# Altium project relay_sheild.PrjPcb
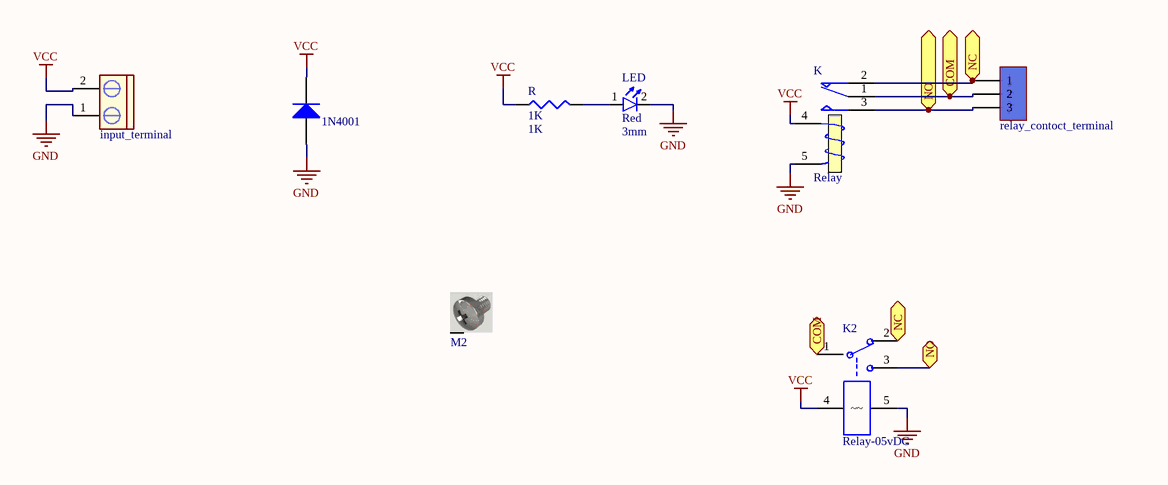
[diagram p0: Sheet1.SchDoc]
2 sheets, 17 parts. Net scope: flat (ports and power ports of the same name join across sheets).
Board files: PCB1.PcbDoc, PCB2.PcbDoc, Dual_Channel_Common_VCC_PCB.PcbDoc, Dual_Channel_Common_VCC_PCB_X2.PcbDoc, Dual_Channel_Common_VCC_PCB_X4.PcbDoc, PCB2_X4.PcbDoc, PCB2_X10.PcbDoc
Sheets:
  Sheet1.SchDoc
  Dual_Channel_Common_VCC.SchDoc

## Sheet Sheet1.SchDoc
size A

### Parts
(Parts that share a designator on the sheet are numbered #1, #2 ... from top to bottom, then left to right.)
1N4001  Diode 1N4007 vertical  [D 50mm]  (value not drawn)
input_terminal#1  CON2 pin blue  [My_CN2]  (value not drawn)
K  Relay  [Relay 15.40x12.10x13.10]
K2  Relay-05vDC  [Relays]
LED  Size: 3mm  [LED-3mm]  (hidden comment: Red)
M2  Screw  [Board Screw_No Silk]  (value not drawn)
R  1K  [AXIAL0.4]
relay_contoct_terminal  Terminal  [Terminal 1*3]  (value not drawn)

### Ports
COM, NC, NO

### Nets
GND: 1N4001.1(A) input_terminal#1.1 K.5(T2) K2.5 LED.2(K)
VCC: 1N4001.2(K) input_terminal#1.2 K.4(T1) K2.4 R.1
NetK_1: K.1(COM) K2.1(COM) relay_contoct_terminal.2 ; port COM
NetK_2: K.2(NC) K2.2(NC) relay_contoct_terminal.1 ; port NC
NetK_3: K.3(NO) K2.3(NO) relay_contoct_terminal.3 ; port NO
NetLED_1: LED.1(A) R.2

Not connected (* = marked no-connect by the designer): M2 S

### Library data of the parts
1N4001 = Diode 1N4007 vertical: 1 Amp General Purpose Rectifier; Publisher: seyed mohsen ghasemian
input_terminal#1 = CON2 pin blue: Connector blue screw
K = Relay: SPDT Relay; Designer: Eng. Saeid Jorablo; Company: E.P.I.L; Design_Date: 2011/10/31
K2 = Relay-05vDC: Relay-05vDC-240AC 5A; Designer: Seyed Mohsen Ghasemain; ComponentLinkURL: www.picpars.com
LED = LED: Designer: Saeid Jorablo; Organazation: ControTec; Adding Date: 1387/12/22; Color: Red
M2 = Board Screw: Board Screw With Spacer
R = Res3: Resistor; Published: 8-Jun-2000; LatestRevisionDate: 29-May-2009; LatestRevisionNote: IPC-7351 Footprint Added.; PackageReference: J1-0603; Publisher: Altium Limited; PackageDescription: Chip Resistor; Value: 1K
relay_contoct_terminal = Terminal 1*3: Terminal 3 Pin 250VAC 16A; Designer: Seyed Mohsen Ghasemain; E-mail: picpars@gmail.com; ComponentLinkURL: www.picpars.com

## Sheet Dual_Channel_Common_VCC.SchDoc
size A
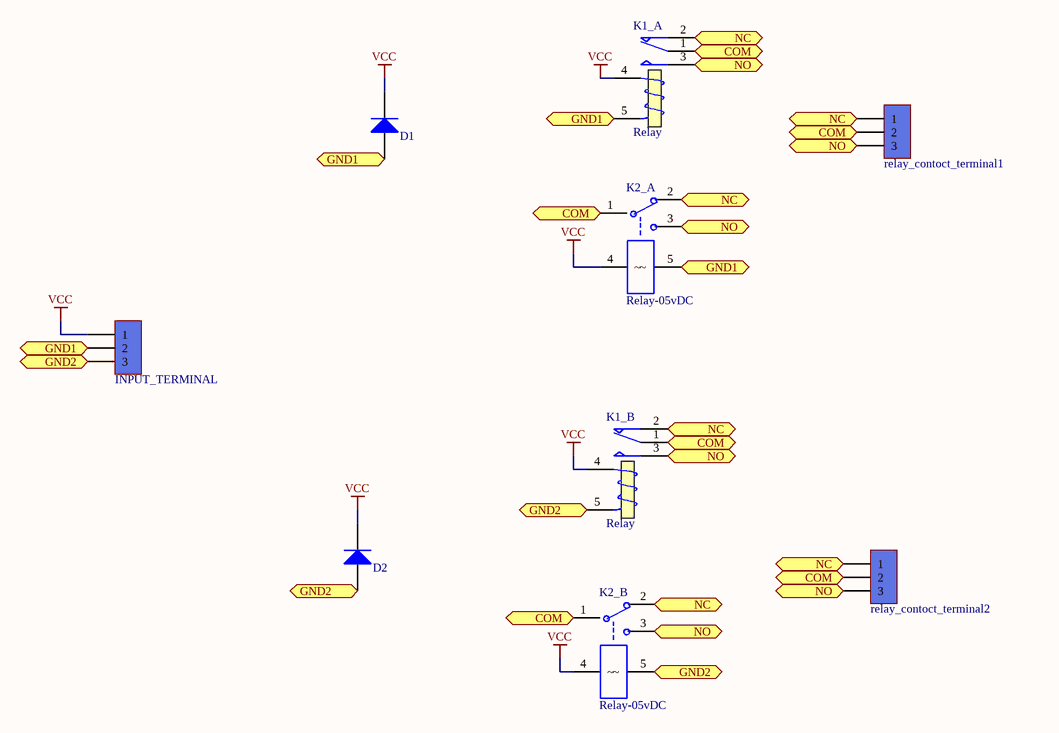
[diagram p1: Dual_Channel_Common_VCC.SchDoc]

### Parts
(Parts that share a designator on the sheet are numbered #1, #2 ... from top to bottom, then left to right.)
D1  Diode 1N4007 vertical  [D 50mm]  (value not drawn)
D2  Diode 1N4007 vertical  [D 50mm]  (value not drawn)
INPUT_TERMINAL#2  Terminal  [Terminal 1*3]  (value not drawn)
K1_A  Relay  [Relay 15.40x12.10x13.10]
K1_B  Relay  [Relay 15.40x12.10x13.10]
K2_A  Relay-05vDC  [Relays]
K2_B  Relay-05vDC  [Relays]
relay_contoct_terminal1  Terminal  [Terminal 1*3]  (value not drawn)
relay_contoct_terminal2  Terminal  [Terminal 1*3]  (value not drawn)

### Ports
COM, GND1, GND2, NC, NO

### Nets
VCC: D1.2(K) D2.2(K) INPUT_TERMINAL#2.1 K1_A.4(T1) K1_B.4(T1) K2_A.4 K2_B.4
NetD1_1: D1.1(A) INPUT_TERMINAL#2.2 K1_A.5(T2) K2_A.5 ; port GND1
NetD2_1: D2.1(A) INPUT_TERMINAL#2.3 K1_B.5(T2) K2_B.5 ; port GND2
NetK_1: K1_A.1(COM) K1_B.1(COM) K2_A.1(COM) K2_B.1(COM) relay_contoct_terminal1.2 relay_contoct_terminal2.2 ; port COM
NetK_2: K1_A.2(NC) K1_B.2(NC) K2_A.2(NC) K2_B.2(NC) relay_contoct_terminal1.1 relay_contoct_terminal2.1 ; port NC
NetK_3: K1_A.3(NO) K1_B.3(NO) K2_A.3(NO) K2_B.3(NO) relay_contoct_terminal1.3 relay_contoct_terminal2.3 ; port NO

### Library data of the parts
D1 D2 = Diode 1N4007 vertical: 1 Amp General Purpose Rectifier; Publisher: seyed mohsen ghasemian
INPUT_TERMINAL#2 relay_contoct_terminal1 relay_contoct_terminal2 = Terminal 1*3: as relay_contoct_terminal on sheet Sheet1; ComponentLinkURL: www.picpars.com
K1_A K1_B = Relay: as K on sheet Sheet1; Design_Date: 2011/10/31
K2_A K2_B = Relay-05vDC: as K2 on sheet Sheet1; ComponentLinkURL: www.picpars.com

## Nets that join several sheets
VCC: Sheet1 (5 pins), Dual_Channel_Common_VCC (7 pins)
NetK_1: Sheet1 (K.1 K2.1 relay_contoct_terminal.2), Dual_Channel_Common_VCC (6 pins)
NetK_2: Sheet1 (K.2 K2.2 relay_contoct_terminal.1), Dual_Channel_Common_VCC (6 pins)
NetK_3: Sheet1 (K.3 K2.3 relay_contoct_terminal.3), Dual_Channel_Common_VCC (6 pins)